# Altium schematic sheet camera.SchDoc
size A3
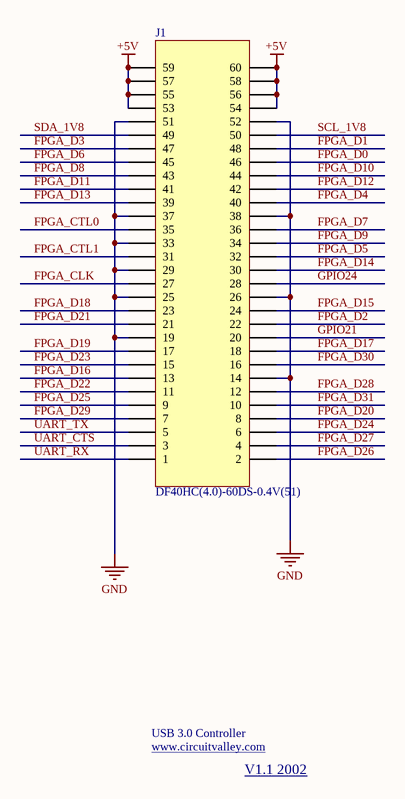
[diagram p0: camera.SchDoc]

## Parts
J1  DF40HC(4.0)-60DS-0.4V(51)  [DF40HC(4.0)-60DS-0.4V(51)]

## Nets
+5V: J1.53 J1.54 J1.55 J1.56 J1.57 J1.58 J1.59 J1.60
GND: J1.14 J1.19 J1.25 J1.26 J1.29 J1.33 J1.37 J1.38 J1.51 J1.52
FPGA_CLK: J1.27
FPGA_CTL0: J1.35
FPGA_CTL1: J1.31
FPGA_D0: J1.46
FPGA_D1: J1.48
FPGA_D2: J1.22
FPGA_D3: J1.47
FPGA_D4: J1.40
FPGA_D5: J1.32
FPGA_D6: J1.45
FPGA_D7: J1.36
FPGA_D8: J1.43
FPGA_D9: J1.34
FPGA_D10: J1.44
FPGA_D11: J1.41
FPGA_D12: J1.42
FPGA_D13: J1.39
FPGA_D14: J1.30
FPGA_D15: J1.24
FPGA_D16: J1.13
FPGA_D17: J1.18
FPGA_D18: J1.23
FPGA_D19: J1.17
FPGA_D20: J1.8
FPGA_D21: J1.21
FPGA_D22: J1.11
FPGA_D23: J1.15
FPGA_D24: J1.6
FPGA_D25: J1.9
FPGA_D26: J1.2
FPGA_D27: J1.4
FPGA_D28: J1.12
FPGA_D29: J1.7
FPGA_D30: J1.16
FPGA_D31: J1.10
GPIO21: J1.20
GPIO24: J1.28
SCL_1V8: J1.50
SDA_1V8: J1.49
UART_CTS: J1.3
UART_RX: J1.1
UART_TX: J1.5

## Notes on the sheet
- USB 3.0 Controller
- www.circuitvalley.com <http://www.circuitvalley.com>
- V1.1 2002
- Title
- Size:
- Date:
- A3
- Number:
- Time:
- Revision:
- Sheet
- of
- File:

## Library data of the parts
J1 = DF40HC(4.0)-60DS-0.4V(51): Hiros 60 pin Connector